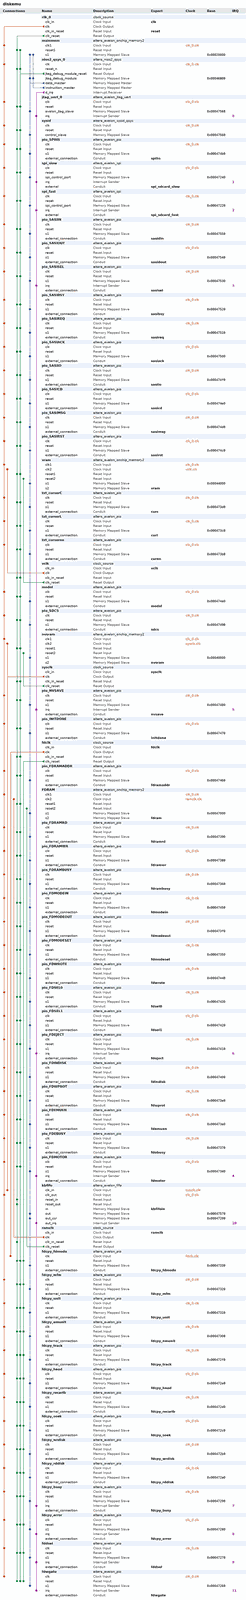
[diagram p0: system contents, whole]
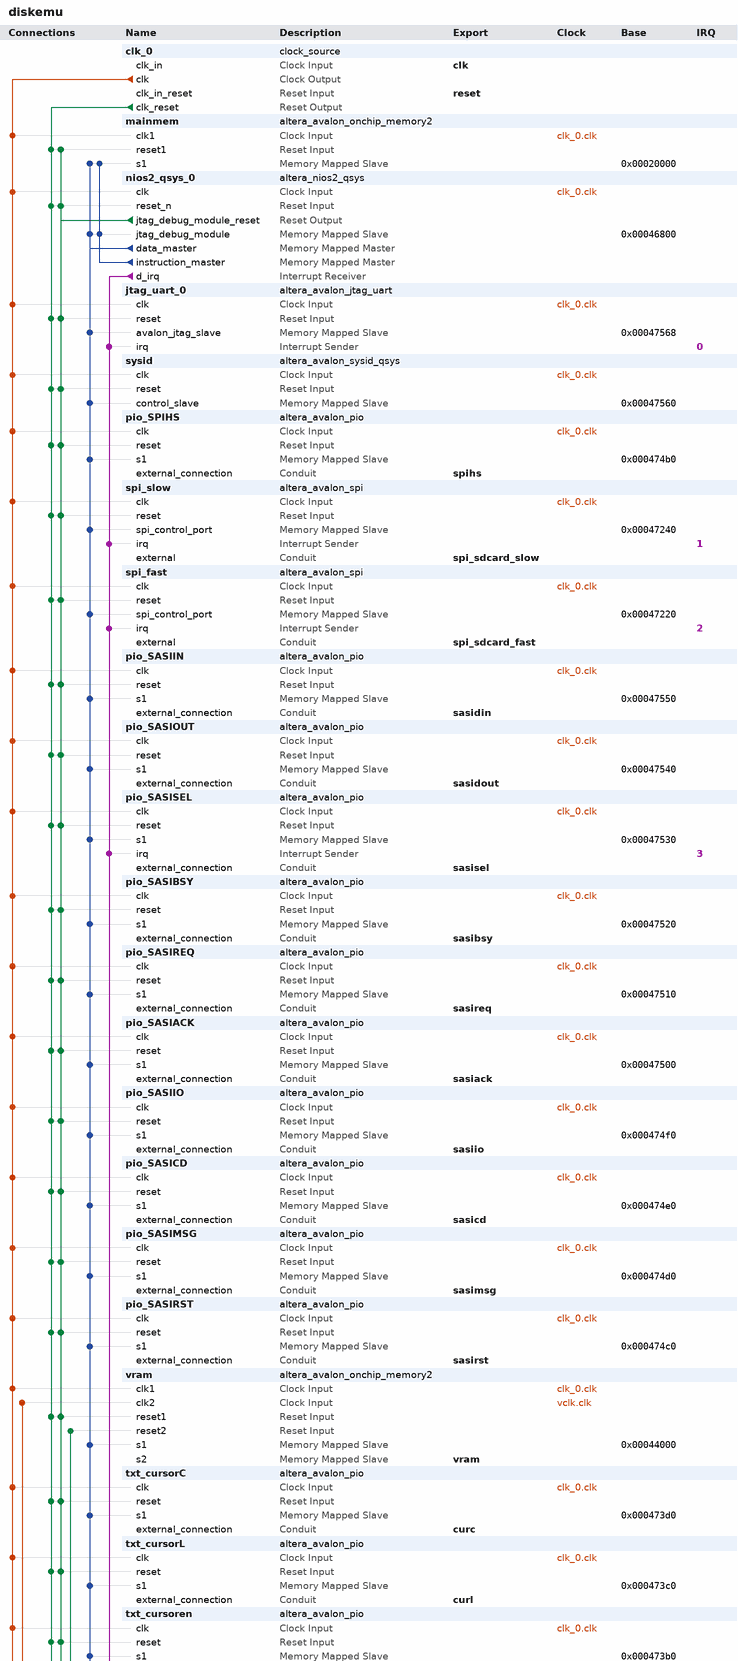
[diagram p1: system contents, upper part]
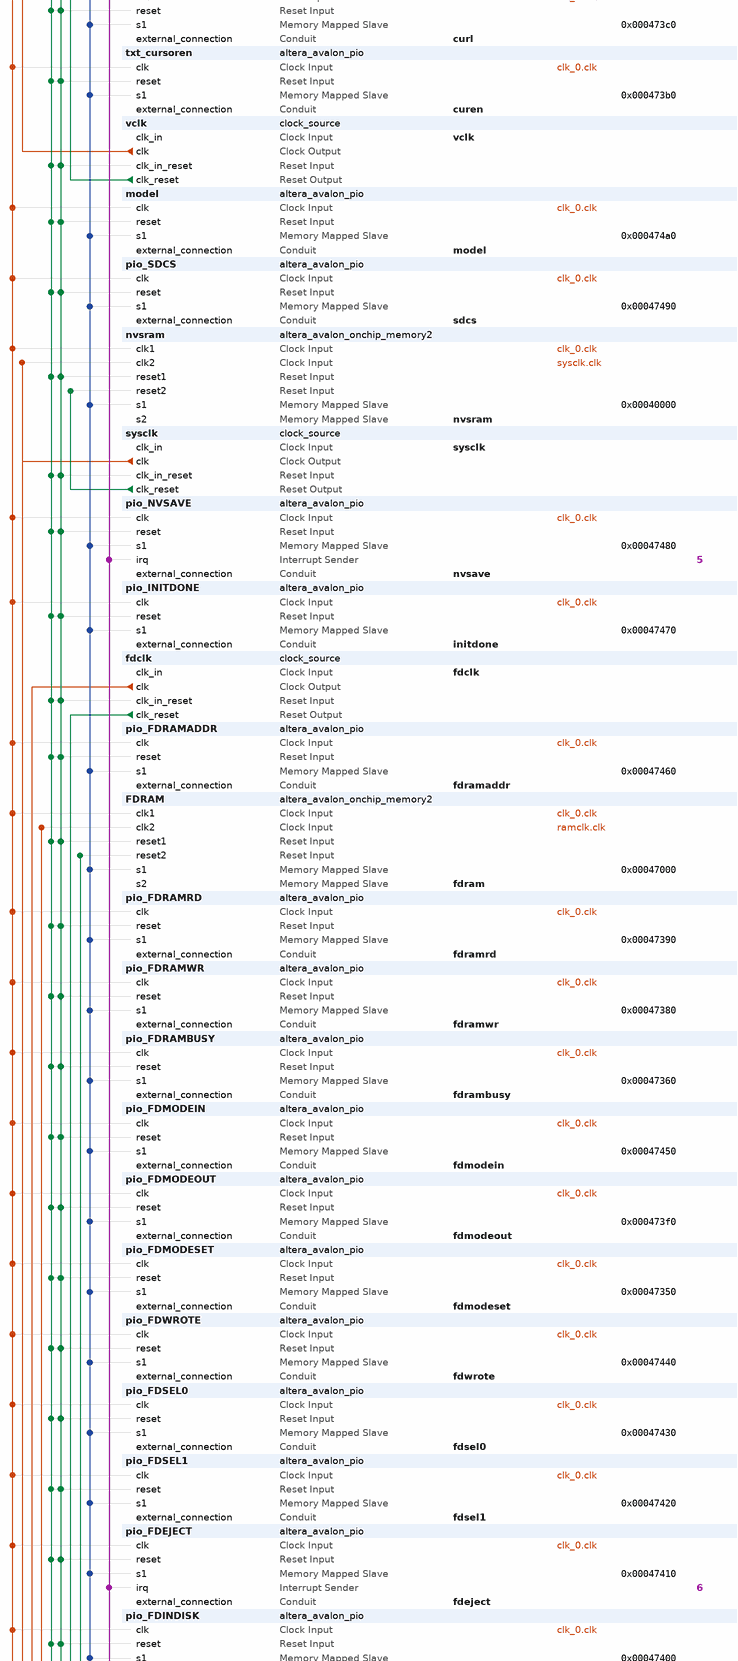
[diagram p2: system contents, middle part]
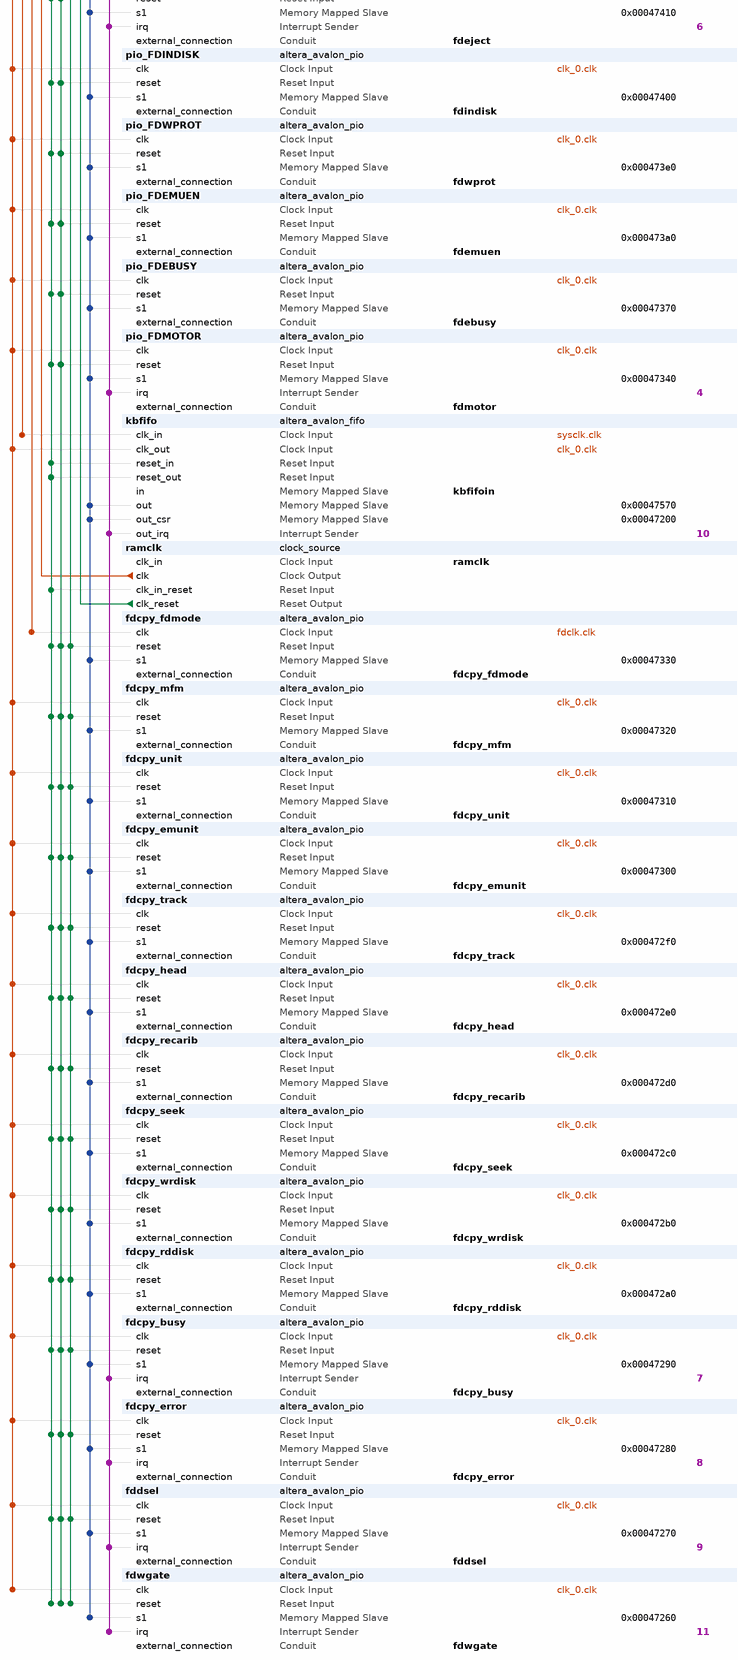
[diagram p3: system contents, lower part]
# Platform Designer (Qsys) system diskemu, Cyclone V 5CEBA4F23C7
# Parameters at their usual value, and those the tool derives, are not listed.
package require -exact qsys 13.1
create_system diskemu
set_project_property DEVICE_FAMILY {Cyclone V}
set_project_property DEVICE 5CEBA4F23C7

add_instance clk_0 clock_source 13.1
set_instance_parameter_value clk_0 clockFrequency 60000000

add_instance mainmem altera_avalon_onchip_memory2 13.1
set_instance_parameter_value mainmem dataWidth 32
set_instance_parameter_value mainmem dualPort false
set_instance_parameter_value mainmem initMemContent true
set_instance_parameter_value mainmem initializationFileName onchip_mem.hex
set_instance_parameter_value mainmem memorySize 98304

add_instance nios2_qsys_0 altera_nios2_qsys 13.1
set_instance_parameter_value nios2_qsys_0 resetSlave mainmem.s1
set_instance_parameter_value nios2_qsys_0 mmu_TLBMissExcSlave None
set_instance_parameter_value nios2_qsys_0 exceptionSlave mainmem.s1
set_instance_parameter_value nios2_qsys_0 breakSlave nios2_qsys_0.jtag_debug_module
set_instance_parameter_value nios2_qsys_0 impl Tiny
set_instance_parameter_value nios2_qsys_0 icache_size 4096

add_instance jtag_uart_0 altera_avalon_jtag_uart 13.1
set_instance_parameter_value jtag_uart_0 simInteractiveOptions NO_INTERACTIVE_WINDOWS

add_instance sysid altera_avalon_sysid_qsys 13.1
set_instance_parameter_value sysid id 0

add_instance pio_SPIHS altera_avalon_pio 13.1
set_instance_parameter_value pio_SPIHS direction Output
set_instance_parameter_value pio_SPIHS width 1

add_instance spi_slow altera_avalon_spi 13.1
set_instance_parameter_value spi_slow clockPhase 1
set_instance_parameter_value spi_slow clockPolarity 1
set_instance_parameter_value spi_slow dataWidth 8
set_instance_parameter_value spi_slow masterSPI true
set_instance_parameter_value spi_slow numberOfSlaves 1
set_instance_parameter_value spi_slow targetClockRate 150000

add_instance spi_fast altera_avalon_spi 13.1
set_instance_parameter_value spi_fast clockPhase 1
set_instance_parameter_value spi_fast clockPolarity 1
set_instance_parameter_value spi_fast dataWidth 8
set_instance_parameter_value spi_fast masterSPI true
set_instance_parameter_value spi_fast numberOfSlaves 1
set_instance_parameter_value spi_fast targetClockRate 20000000

add_instance pio_SASIIN altera_avalon_pio 13.1
set_instance_parameter_value pio_SASIIN captureEdge true
set_instance_parameter_value pio_SASIIN direction Input
set_instance_parameter_value pio_SASIIN width 8

add_instance pio_SASIOUT altera_avalon_pio 13.1
set_instance_parameter_value pio_SASIOUT direction Output
set_instance_parameter_value pio_SASIOUT width 8

add_instance pio_SASISEL altera_avalon_pio 13.1
set_instance_parameter_value pio_SASISEL captureEdge true
set_instance_parameter_value pio_SASISEL direction Input
set_instance_parameter_value pio_SASISEL generateIRQ true
set_instance_parameter_value pio_SASISEL width 1

add_instance pio_SASIBSY altera_avalon_pio 13.1
set_instance_parameter_value pio_SASIBSY direction Output
set_instance_parameter_value pio_SASIBSY width 1

add_instance pio_SASIREQ altera_avalon_pio 13.1
set_instance_parameter_value pio_SASIREQ direction Output
set_instance_parameter_value pio_SASIREQ width 1

add_instance pio_SASIACK altera_avalon_pio 13.1
set_instance_parameter_value pio_SASIACK captureEdge true
set_instance_parameter_value pio_SASIACK direction Input
set_instance_parameter_value pio_SASIACK width 1

add_instance pio_SASIIO altera_avalon_pio 13.1
set_instance_parameter_value pio_SASIIO direction Output
set_instance_parameter_value pio_SASIIO width 1

add_instance pio_SASICD altera_avalon_pio 13.1
set_instance_parameter_value pio_SASICD captureEdge true
set_instance_parameter_value pio_SASICD direction Output
set_instance_parameter_value pio_SASICD width 1

add_instance pio_SASIMSG altera_avalon_pio 13.1
set_instance_parameter_value pio_SASIMSG direction Output
set_instance_parameter_value pio_SASIMSG width 1

add_instance pio_SASIRST altera_avalon_pio 13.1
set_instance_parameter_value pio_SASIRST captureEdge true
set_instance_parameter_value pio_SASIRST direction Input
set_instance_parameter_value pio_SASIRST width 1

add_instance vram altera_avalon_onchip_memory2 13.1
set_instance_parameter_value vram dataWidth 8
set_instance_parameter_value vram dualPort true
set_instance_parameter_value vram initMemContent false
set_instance_parameter_value vram initializationFileName onchip_mem.hex
set_instance_parameter_value vram memorySize 8192

add_instance txt_cursorC altera_avalon_pio 13.1
set_instance_parameter_value txt_cursorC direction Output
set_instance_parameter_value txt_cursorC width 7

add_instance txt_cursorL altera_avalon_pio 13.1
set_instance_parameter_value txt_cursorL direction Output
set_instance_parameter_value txt_cursorL width 6

add_instance txt_cursoren altera_avalon_pio 13.1
set_instance_parameter_value txt_cursoren direction Output
set_instance_parameter_value txt_cursoren width 1

add_instance vclk clock_source 13.1
set_instance_parameter_value vclk clockFrequency 80000000

add_instance model altera_avalon_pio 13.1
set_instance_parameter_value model direction Input
set_instance_parameter_value model width 8

add_instance pio_SDCS altera_avalon_pio 13.1
set_instance_parameter_value pio_SDCS direction Output
set_instance_parameter_value pio_SDCS resetValue 1
set_instance_parameter_value pio_SDCS width 1

add_instance nvsram altera_avalon_onchip_memory2 13.1
set_instance_parameter_value nvsram dataWidth 16
set_instance_parameter_value nvsram dualPort true
set_instance_parameter_value nvsram initMemContent true
set_instance_parameter_value nvsram initializationFileName "H:\\FPGA\\diskemu.v2\\sramdefault.hex"
set_instance_parameter_value nvsram memorySize 16384
set_instance_parameter_value nvsram useNonDefaultInitFile true

add_instance sysclk clock_source 13.1
set_instance_parameter_value sysclk clockFrequency 10000000

add_instance pio_NVSAVE altera_avalon_pio 13.1
set_instance_parameter_value pio_NVSAVE captureEdge true
set_instance_parameter_value pio_NVSAVE direction Input
set_instance_parameter_value pio_NVSAVE generateIRQ true
set_instance_parameter_value pio_NVSAVE irqType EDGE
set_instance_parameter_value pio_NVSAVE width 1

add_instance pio_INITDONE altera_avalon_pio 13.1
set_instance_parameter_value pio_INITDONE direction Output
set_instance_parameter_value pio_INITDONE width 1

add_instance fdclk clock_source 13.1
set_instance_parameter_value fdclk clockFrequency 30000000

add_instance pio_FDRAMADDR altera_avalon_pio 13.1
set_instance_parameter_value pio_FDRAMADDR direction Output
set_instance_parameter_value pio_FDRAMADDR edgeType ANY
set_instance_parameter_value pio_FDRAMADDR width 16

add_instance FDRAM altera_avalon_onchip_memory2 13.1
set_instance_parameter_value FDRAM dataWidth 16
set_instance_parameter_value FDRAM dualPort true
set_instance_parameter_value FDRAM initMemContent false
set_instance_parameter_value FDRAM initializationFileName onchip_mem.hex
set_instance_parameter_value FDRAM memorySize 512

add_instance pio_FDRAMRD altera_avalon_pio 13.1
set_instance_parameter_value pio_FDRAMRD direction Output
set_instance_parameter_value pio_FDRAMRD edgeType ANY
set_instance_parameter_value pio_FDRAMRD width 1

add_instance pio_FDRAMWR altera_avalon_pio 13.1
set_instance_parameter_value pio_FDRAMWR direction Output
set_instance_parameter_value pio_FDRAMWR edgeType ANY
set_instance_parameter_value pio_FDRAMWR width 1

add_instance pio_FDRAMBUSY altera_avalon_pio 13.1
set_instance_parameter_value pio_FDRAMBUSY direction Input
set_instance_parameter_value pio_FDRAMBUSY edgeType ANY
set_instance_parameter_value pio_FDRAMBUSY width 1

add_instance pio_FDMODEIN altera_avalon_pio 13.1
set_instance_parameter_value pio_FDMODEIN direction Input
set_instance_parameter_value pio_FDMODEIN width 8

add_instance pio_FDMODEOUT altera_avalon_pio 13.1
set_instance_parameter_value pio_FDMODEOUT direction Output
set_instance_parameter_value pio_FDMODEOUT width 8

add_instance pio_FDMODESET altera_avalon_pio 13.1
set_instance_parameter_value pio_FDMODESET direction Output
set_instance_parameter_value pio_FDMODESET width 4

add_instance pio_FDWROTE altera_avalon_pio 13.1
set_instance_parameter_value pio_FDWROTE captureEdge true
set_instance_parameter_value pio_FDWROTE direction Input
set_instance_parameter_value pio_FDWROTE width 4

add_instance pio_FDSEL0 altera_avalon_pio 13.1
set_instance_parameter_value pio_FDSEL0 direction Output
set_instance_parameter_value pio_FDSEL0 resetValue 1
set_instance_parameter_value pio_FDSEL0 width 4

add_instance pio_FDSEL1 altera_avalon_pio 13.1
set_instance_parameter_value pio_FDSEL1 direction Output
set_instance_parameter_value pio_FDSEL1 resetValue 2
set_instance_parameter_value pio_FDSEL1 width 4

add_instance pio_FDEJECT altera_avalon_pio 13.1
set_instance_parameter_value pio_FDEJECT captureEdge true
set_instance_parameter_value pio_FDEJECT direction Input
set_instance_parameter_value pio_FDEJECT generateIRQ true
set_instance_parameter_value pio_FDEJECT irqType EDGE
set_instance_parameter_value pio_FDEJECT width 4

add_instance pio_FDINDISK altera_avalon_pio 13.1
set_instance_parameter_value pio_FDINDISK direction Output
set_instance_parameter_value pio_FDINDISK width 4

add_instance pio_FDWPROT altera_avalon_pio 13.1
set_instance_parameter_value pio_FDWPROT direction Output
set_instance_parameter_value pio_FDWPROT width 4

add_instance pio_FDEMUEN altera_avalon_pio 13.1
set_instance_parameter_value pio_FDEMUEN direction Output
set_instance_parameter_value pio_FDEMUEN width 4

add_instance pio_FDEBUSY altera_avalon_pio 13.1
set_instance_parameter_value pio_FDEBUSY direction Output
set_instance_parameter_value pio_FDEBUSY width 1

add_instance pio_FDMOTOR altera_avalon_pio 13.1
set_instance_parameter_value pio_FDMOTOR captureEdge true
set_instance_parameter_value pio_FDMOTOR direction Input
set_instance_parameter_value pio_FDMOTOR edgeType FALLING
set_instance_parameter_value pio_FDMOTOR generateIRQ true
set_instance_parameter_value pio_FDMOTOR irqType EDGE
set_instance_parameter_value pio_FDMOTOR width 4

add_instance kbfifo altera_avalon_fifo 13.1
set_instance_parameter_value kbfifo bitsPerSymbol 16
set_instance_parameter_value kbfifo channelWidth 8
set_instance_parameter_value kbfifo errorWidth 8
set_instance_parameter_value kbfifo fifoDepth 16
set_instance_parameter_value kbfifo fifoInputInterfaceOptions AVALONMM_WRITE
set_instance_parameter_value kbfifo fifoOutputInterfaceOptions AVALONMM_READ
set_instance_parameter_value kbfifo singleClockMode false
set_instance_parameter_value kbfifo singleResetMode true
set_instance_parameter_value kbfifo symbolsPerBeat 2
set_instance_parameter_value kbfifo useIRQ true
set_instance_parameter_value kbfifo usePacket true
set_instance_parameter_value kbfifo useReadControl true
set_instance_parameter_value kbfifo useWriteControl false

add_instance ramclk clock_source 13.1
set_instance_parameter_value ramclk clockFrequency 10000000

add_instance fdcpy_fdmode altera_avalon_pio 13.1
set_instance_parameter_value fdcpy_fdmode direction Output
set_instance_parameter_value fdcpy_fdmode width 2

add_instance fdcpy_mfm altera_avalon_pio 13.1
set_instance_parameter_value fdcpy_mfm direction Output
set_instance_parameter_value fdcpy_mfm width 1

add_instance fdcpy_unit altera_avalon_pio 13.1
set_instance_parameter_value fdcpy_unit direction Output
set_instance_parameter_value fdcpy_unit width 1

add_instance fdcpy_emunit altera_avalon_pio 13.1
set_instance_parameter_value fdcpy_emunit direction Output
set_instance_parameter_value fdcpy_emunit width 2

add_instance fdcpy_track altera_avalon_pio 13.1
set_instance_parameter_value fdcpy_track direction Output
set_instance_parameter_value fdcpy_track width 7

add_instance fdcpy_head altera_avalon_pio 13.1
set_instance_parameter_value fdcpy_head direction Output
set_instance_parameter_value fdcpy_head width 1

add_instance fdcpy_recarib altera_avalon_pio 13.1
set_instance_parameter_value fdcpy_recarib direction Output
set_instance_parameter_value fdcpy_recarib width 1

add_instance fdcpy_seek altera_avalon_pio 13.1
set_instance_parameter_value fdcpy_seek direction Output
set_instance_parameter_value fdcpy_seek width 1

add_instance fdcpy_wrdisk altera_avalon_pio 13.1
set_instance_parameter_value fdcpy_wrdisk direction Output
set_instance_parameter_value fdcpy_wrdisk width 1

add_instance fdcpy_rddisk altera_avalon_pio 13.1
set_instance_parameter_value fdcpy_rddisk direction Output
set_instance_parameter_value fdcpy_rddisk width 1

add_instance fdcpy_busy altera_avalon_pio 13.1
set_instance_parameter_value fdcpy_busy captureEdge true
set_instance_parameter_value fdcpy_busy direction Input
set_instance_parameter_value fdcpy_busy edgeType FALLING
set_instance_parameter_value fdcpy_busy generateIRQ true
set_instance_parameter_value fdcpy_busy width 1

add_instance fdcpy_error altera_avalon_pio 13.1
set_instance_parameter_value fdcpy_error captureEdge true
set_instance_parameter_value fdcpy_error direction Input
set_instance_parameter_value fdcpy_error generateIRQ true
set_instance_parameter_value fdcpy_error width 1

add_instance fddsel altera_avalon_pio 13.1
set_instance_parameter_value fddsel captureEdge true
set_instance_parameter_value fddsel direction Input
set_instance_parameter_value fddsel edgeType ANY
set_instance_parameter_value fddsel generateIRQ true
set_instance_parameter_value fddsel irqType EDGE
set_instance_parameter_value fddsel width 4

add_instance fdwgate altera_avalon_pio 13.1
set_instance_parameter_value fdwgate captureEdge true
set_instance_parameter_value fdwgate direction Input
set_instance_parameter_value fdwgate edgeType ANY
set_instance_parameter_value fdwgate generateIRQ true
set_instance_parameter_value fdwgate irqType EDGE
set_instance_parameter_value fdwgate width 1

# connections
add_connection clk_0.clk fdcpy_busy.clk clock
add_connection clk_0.clk fdcpy_emunit.clk clock
add_connection clk_0.clk fdcpy_error.clk clock
add_connection clk_0.clk fdcpy_head.clk clock
add_connection clk_0.clk fdcpy_mfm.clk clock
add_connection clk_0.clk fdcpy_rddisk.clk clock
add_connection clk_0.clk fdcpy_recarib.clk clock
add_connection clk_0.clk fdcpy_seek.clk clock
add_connection clk_0.clk fdcpy_track.clk clock
add_connection clk_0.clk fdcpy_unit.clk clock
add_connection clk_0.clk fdcpy_wrdisk.clk clock
add_connection clk_0.clk fddsel.clk clock
add_connection clk_0.clk FDRAM.clk1 clock
add_connection clk_0.clk fdwgate.clk clock
add_connection clk_0.clk jtag_uart_0.clk clock
add_connection clk_0.clk kbfifo.clk_out clock
add_connection clk_0.clk mainmem.clk1 clock
add_connection clk_0.clk model.clk clock
add_connection clk_0.clk nios2_qsys_0.clk clock
add_connection clk_0.clk nvsram.clk1 clock
add_connection clk_0.clk pio_FDEBUSY.clk clock
add_connection clk_0.clk pio_FDEJECT.clk clock
add_connection clk_0.clk pio_FDEMUEN.clk clock
add_connection clk_0.clk pio_FDINDISK.clk clock
add_connection clk_0.clk pio_FDMODEIN.clk clock
add_connection clk_0.clk pio_FDMODEOUT.clk clock
add_connection clk_0.clk pio_FDMODESET.clk clock
add_connection clk_0.clk pio_FDMOTOR.clk clock
add_connection clk_0.clk pio_FDRAMADDR.clk clock
add_connection clk_0.clk pio_FDRAMBUSY.clk clock
add_connection clk_0.clk pio_FDRAMRD.clk clock
add_connection clk_0.clk pio_FDRAMWR.clk clock
add_connection clk_0.clk pio_FDSEL0.clk clock
add_connection clk_0.clk pio_FDSEL1.clk clock
add_connection clk_0.clk pio_FDWPROT.clk clock
add_connection clk_0.clk pio_FDWROTE.clk clock
add_connection clk_0.clk pio_INITDONE.clk clock
add_connection clk_0.clk pio_NVSAVE.clk clock
add_connection clk_0.clk pio_SASIACK.clk clock
add_connection clk_0.clk pio_SASIBSY.clk clock
add_connection clk_0.clk pio_SASICD.clk clock
add_connection clk_0.clk pio_SASIIN.clk clock
add_connection clk_0.clk pio_SASIIO.clk clock
add_connection clk_0.clk pio_SASIMSG.clk clock
add_connection clk_0.clk pio_SASIOUT.clk clock
add_connection clk_0.clk pio_SASIREQ.clk clock
add_connection clk_0.clk pio_SASIRST.clk clock
add_connection clk_0.clk pio_SASISEL.clk clock
add_connection clk_0.clk pio_SDCS.clk clock
add_connection clk_0.clk pio_SPIHS.clk clock
add_connection clk_0.clk spi_fast.clk clock
add_connection clk_0.clk spi_slow.clk clock
add_connection clk_0.clk sysid.clk clock
add_connection clk_0.clk txt_cursorC.clk clock
add_connection clk_0.clk txt_cursoren.clk clock
add_connection clk_0.clk txt_cursorL.clk clock
add_connection clk_0.clk vram.clk1 clock
add_connection fdclk.clk fdcpy_fdmode.clk clock
add_connection ramclk.clk FDRAM.clk2 clock
add_connection sysclk.clk kbfifo.clk_in clock
add_connection sysclk.clk nvsram.clk2 clock
add_connection vclk.clk vram.clk2 clock
add_connection clk_0.clk_reset fdclk.clk_in_reset reset
add_connection clk_0.clk_reset fdcpy_busy.reset reset
add_connection clk_0.clk_reset fdcpy_emunit.reset reset
add_connection clk_0.clk_reset fdcpy_error.reset reset
add_connection clk_0.clk_reset fdcpy_fdmode.reset reset
add_connection clk_0.clk_reset fdcpy_head.reset reset
add_connection clk_0.clk_reset fdcpy_mfm.reset reset
add_connection clk_0.clk_reset fdcpy_rddisk.reset reset
add_connection clk_0.clk_reset fdcpy_recarib.reset reset
add_connection clk_0.clk_reset fdcpy_seek.reset reset
add_connection clk_0.clk_reset fdcpy_track.reset reset
add_connection clk_0.clk_reset fdcpy_unit.reset reset
add_connection clk_0.clk_reset fdcpy_wrdisk.reset reset
add_connection clk_0.clk_reset fddsel.reset reset
add_connection clk_0.clk_reset FDRAM.reset1 reset
add_connection clk_0.clk_reset fdwgate.reset reset
add_connection clk_0.clk_reset jtag_uart_0.reset reset
add_connection clk_0.clk_reset kbfifo.reset_in reset
add_connection clk_0.clk_reset kbfifo.reset_out reset
add_connection clk_0.clk_reset mainmem.reset1 reset
add_connection clk_0.clk_reset model.reset reset
add_connection clk_0.clk_reset nios2_qsys_0.reset_n reset
add_connection clk_0.clk_reset nvsram.reset1 reset
add_connection clk_0.clk_reset pio_FDEBUSY.reset reset
add_connection clk_0.clk_reset pio_FDEJECT.reset reset
add_connection clk_0.clk_reset pio_FDEMUEN.reset reset
add_connection clk_0.clk_reset pio_FDINDISK.reset reset
add_connection clk_0.clk_reset pio_FDMODEIN.reset reset
add_connection clk_0.clk_reset pio_FDMODEOUT.reset reset
add_connection clk_0.clk_reset pio_FDMODESET.reset reset
add_connection clk_0.clk_reset pio_FDMOTOR.reset reset
add_connection clk_0.clk_reset pio_FDRAMADDR.reset reset
add_connection clk_0.clk_reset pio_FDRAMBUSY.reset reset
add_connection clk_0.clk_reset pio_FDRAMRD.reset reset
add_connection clk_0.clk_reset pio_FDRAMWR.reset reset
add_connection clk_0.clk_reset pio_FDSEL0.reset reset
add_connection clk_0.clk_reset pio_FDSEL1.reset reset
add_connection clk_0.clk_reset pio_FDWPROT.reset reset
add_connection clk_0.clk_reset pio_FDWROTE.reset reset
add_connection clk_0.clk_reset pio_INITDONE.reset reset
add_connection clk_0.clk_reset pio_NVSAVE.reset reset
add_connection clk_0.clk_reset pio_SASIACK.reset reset
add_connection clk_0.clk_reset pio_SASIBSY.reset reset
add_connection clk_0.clk_reset pio_SASICD.reset reset
add_connection clk_0.clk_reset pio_SASIIN.reset reset
add_connection clk_0.clk_reset pio_SASIIO.reset reset
add_connection clk_0.clk_reset pio_SASIMSG.reset reset
add_connection clk_0.clk_reset pio_SASIOUT.reset reset
add_connection clk_0.clk_reset pio_SASIREQ.reset reset
add_connection clk_0.clk_reset pio_SASIRST.reset reset
add_connection clk_0.clk_reset pio_SASISEL.reset reset
add_connection clk_0.clk_reset pio_SDCS.reset reset
add_connection clk_0.clk_reset pio_SPIHS.reset reset
add_connection clk_0.clk_reset ramclk.clk_in_reset reset
add_connection clk_0.clk_reset spi_fast.reset reset
add_connection clk_0.clk_reset spi_slow.reset reset
add_connection clk_0.clk_reset sysclk.clk_in_reset reset
add_connection clk_0.clk_reset sysid.reset reset
add_connection clk_0.clk_reset txt_cursorC.reset reset
add_connection clk_0.clk_reset txt_cursoren.reset reset
add_connection clk_0.clk_reset txt_cursorL.reset reset
add_connection clk_0.clk_reset vclk.clk_in_reset reset
add_connection clk_0.clk_reset vram.reset1 reset
add_connection fdclk.clk_reset fdcpy_busy.reset reset
add_connection fdclk.clk_reset fdcpy_emunit.reset reset
add_connection fdclk.clk_reset fdcpy_error.reset reset
add_connection fdclk.clk_reset fdcpy_fdmode.reset reset
add_connection fdclk.clk_reset fdcpy_head.reset reset
add_connection fdclk.clk_reset fdcpy_mfm.reset reset
add_connection fdclk.clk_reset fdcpy_rddisk.reset reset
add_connection fdclk.clk_reset fdcpy_recarib.reset reset
add_connection fdclk.clk_reset fdcpy_seek.reset reset
add_connection fdclk.clk_reset fdcpy_track.reset reset
add_connection fdclk.clk_reset fdcpy_unit.reset reset
add_connection fdclk.clk_reset fdcpy_wrdisk.reset reset
add_connection fdclk.clk_reset fddsel.reset reset
add_connection fdclk.clk_reset fdwgate.reset reset
add_connection nios2_qsys_0.jtag_debug_module_reset fdclk.clk_in_reset reset
add_connection nios2_qsys_0.jtag_debug_module_reset fdcpy_busy.reset reset
add_connection nios2_qsys_0.jtag_debug_module_reset fdcpy_emunit.reset reset
add_connection nios2_qsys_0.jtag_debug_module_reset fdcpy_error.reset reset
add_connection nios2_qsys_0.jtag_debug_module_reset fdcpy_fdmode.reset reset
add_connection nios2_qsys_0.jtag_debug_module_reset fdcpy_head.reset reset
add_connection nios2_qsys_0.jtag_debug_module_reset fdcpy_mfm.reset reset
add_connection nios2_qsys_0.jtag_debug_module_reset fdcpy_rddisk.reset reset
add_connection nios2_qsys_0.jtag_debug_module_reset fdcpy_recarib.reset reset
add_connection nios2_qsys_0.jtag_debug_module_reset fdcpy_seek.reset reset
add_connection nios2_qsys_0.jtag_debug_module_reset fdcpy_track.reset reset
add_connection nios2_qsys_0.jtag_debug_module_reset fdcpy_unit.reset reset
add_connection nios2_qsys_0.jtag_debug_module_reset fdcpy_wrdisk.reset reset
add_connection nios2_qsys_0.jtag_debug_module_reset fddsel.reset reset
add_connection nios2_qsys_0.jtag_debug_module_reset FDRAM.reset1 reset
add_connection nios2_qsys_0.jtag_debug_module_reset fdwgate.reset reset
add_connection nios2_qsys_0.jtag_debug_module_reset jtag_uart_0.reset reset
add_connection nios2_qsys_0.jtag_debug_module_reset mainmem.reset1 reset
add_connection nios2_qsys_0.jtag_debug_module_reset model.reset reset
add_connection nios2_qsys_0.jtag_debug_module_reset nios2_qsys_0.reset_n reset
add_connection nios2_qsys_0.jtag_debug_module_reset nvsram.reset1 reset
add_connection nios2_qsys_0.jtag_debug_module_reset pio_FDEBUSY.reset reset
add_connection nios2_qsys_0.jtag_debug_module_reset pio_FDEJECT.reset reset
add_connection nios2_qsys_0.jtag_debug_module_reset pio_FDEMUEN.reset reset
add_connection nios2_qsys_0.jtag_debug_module_reset pio_FDINDISK.reset reset
add_connection nios2_qsys_0.jtag_debug_module_reset pio_FDMODEIN.reset reset
add_connection nios2_qsys_0.jtag_debug_module_reset pio_FDMODEOUT.reset reset
add_connection nios2_qsys_0.jtag_debug_module_reset pio_FDMODESET.reset reset
add_connection nios2_qsys_0.jtag_debug_module_reset pio_FDMOTOR.reset reset
add_connection nios2_qsys_0.jtag_debug_module_reset pio_FDRAMADDR.reset reset
add_connection nios2_qsys_0.jtag_debug_module_reset pio_FDRAMBUSY.reset reset
add_connection nios2_qsys_0.jtag_debug_module_reset pio_FDRAMRD.reset reset
add_connection nios2_qsys_0.jtag_debug_module_reset pio_FDRAMWR.reset reset
add_connection nios2_qsys_0.jtag_debug_module_reset pio_FDSEL0.reset reset
add_connection nios2_qsys_0.jtag_debug_module_reset pio_FDSEL1.reset reset
add_connection nios2_qsys_0.jtag_debug_module_reset pio_FDWPROT.reset reset
add_connection nios2_qsys_0.jtag_debug_module_reset pio_FDWROTE.reset reset
add_connection nios2_qsys_0.jtag_debug_module_reset pio_INITDONE.reset reset
add_connection nios2_qsys_0.jtag_debug_module_reset pio_NVSAVE.reset reset
add_connection nios2_qsys_0.jtag_debug_module_reset pio_SASIACK.reset reset
add_connection nios2_qsys_0.jtag_debug_module_reset pio_SASIBSY.reset reset
add_connection nios2_qsys_0.jtag_debug_module_reset pio_SASICD.reset reset
add_connection nios2_qsys_0.jtag_debug_module_reset pio_SASIIN.reset reset
add_connection nios2_qsys_0.jtag_debug_module_reset pio_SASIIO.reset reset
add_connection nios2_qsys_0.jtag_debug_module_reset pio_SASIMSG.reset reset
add_connection nios2_qsys_0.jtag_debug_module_reset pio_SASIOUT.reset reset
add_connection nios2_qsys_0.jtag_debug_module_reset pio_SASIREQ.reset reset
add_connection nios2_qsys_0.jtag_debug_module_reset pio_SASIRST.reset reset
add_connection nios2_qsys_0.jtag_debug_module_reset pio_SASISEL.reset reset
add_connection nios2_qsys_0.jtag_debug_module_reset pio_SDCS.reset reset
add_connection nios2_qsys_0.jtag_debug_module_reset pio_SPIHS.reset reset
add_connection nios2_qsys_0.jtag_debug_module_reset spi_fast.reset reset
add_connection nios2_qsys_0.jtag_debug_module_reset spi_slow.reset reset
add_connection nios2_qsys_0.jtag_debug_module_reset sysclk.clk_in_reset reset
add_connection nios2_qsys_0.jtag_debug_module_reset sysid.reset reset
add_connection nios2_qsys_0.jtag_debug_module_reset txt_cursorC.reset reset
add_connection nios2_qsys_0.jtag_debug_module_reset txt_cursoren.reset reset
add_connection nios2_qsys_0.jtag_debug_module_reset txt_cursorL.reset reset
add_connection nios2_qsys_0.jtag_debug_module_reset vclk.clk_in_reset reset
add_connection nios2_qsys_0.jtag_debug_module_reset vram.reset1 reset
add_connection ramclk.clk_reset FDRAM.reset2 reset
add_connection sysclk.clk_reset nvsram.reset2 reset
add_connection vclk.clk_reset vram.reset2 reset
add_connection nios2_qsys_0.data_master fdcpy_busy.s1 avalon
set_connection_parameter_value nios2_qsys_0.data_master/fdcpy_busy.s1 baseAddress 0x00047290
add_connection nios2_qsys_0.data_master fdcpy_emunit.s1 avalon
set_connection_parameter_value nios2_qsys_0.data_master/fdcpy_emunit.s1 baseAddress 0x00047300
add_connection nios2_qsys_0.data_master fdcpy_error.s1 avalon
set_connection_parameter_value nios2_qsys_0.data_master/fdcpy_error.s1 baseAddress 0x00047280
add_connection nios2_qsys_0.data_master fdcpy_fdmode.s1 avalon
set_connection_parameter_value nios2_qsys_0.data_master/fdcpy_fdmode.s1 baseAddress 0x00047330
add_connection nios2_qsys_0.data_master fdcpy_head.s1 avalon
set_connection_parameter_value nios2_qsys_0.data_master/fdcpy_head.s1 baseAddress 0x000472e0
add_connection nios2_qsys_0.data_master fdcpy_mfm.s1 avalon
set_connection_parameter_value nios2_qsys_0.data_master/fdcpy_mfm.s1 baseAddress 0x00047320
add_connection nios2_qsys_0.data_master fdcpy_rddisk.s1 avalon
set_connection_parameter_value nios2_qsys_0.data_master/fdcpy_rddisk.s1 baseAddress 0x000472a0
add_connection nios2_qsys_0.data_master fdcpy_recarib.s1 avalon
set_connection_parameter_value nios2_qsys_0.data_master/fdcpy_recarib.s1 baseAddress 0x000472d0
add_connection nios2_qsys_0.data_master fdcpy_seek.s1 avalon
set_connection_parameter_value nios2_qsys_0.data_master/fdcpy_seek.s1 baseAddress 0x000472c0
add_connection nios2_qsys_0.data_master fdcpy_track.s1 avalon
set_connection_parameter_value nios2_qsys_0.data_master/fdcpy_track.s1 baseAddress 0x000472f0
add_connection nios2_qsys_0.data_master fdcpy_unit.s1 avalon
set_connection_parameter_value nios2_qsys_0.data_master/fdcpy_unit.s1 baseAddress 0x00047310
add_connection nios2_qsys_0.data_master fdcpy_wrdisk.s1 avalon
set_connection_parameter_value nios2_qsys_0.data_master/fdcpy_wrdisk.s1 baseAddress 0x000472b0
add_connection nios2_qsys_0.data_master fddsel.s1 avalon
set_connection_parameter_value nios2_qsys_0.data_master/fddsel.s1 baseAddress 0x00047270
add_connection nios2_qsys_0.data_master FDRAM.s1 avalon
set_connection_parameter_value nios2_qsys_0.data_master/FDRAM.s1 baseAddress 0x00047000
add_connection nios2_qsys_0.data_master fdwgate.s1 avalon
set_connection_parameter_value nios2_qsys_0.data_master/fdwgate.s1 baseAddress 0x00047260
add_connection nios2_qsys_0.data_master jtag_uart_0.avalon_jtag_slave avalon
set_connection_parameter_value nios2_qsys_0.data_master/jtag_uart_0.avalon_jtag_slave baseAddress 0x00047568
add_connection nios2_qsys_0.data_master kbfifo.out avalon
set_connection_parameter_value nios2_qsys_0.data_master/kbfifo.out baseAddress 0x00047570
add_connection nios2_qsys_0.data_master kbfifo.out_csr avalon
set_connection_parameter_value nios2_qsys_0.data_master/kbfifo.out_csr baseAddress 0x00047200
add_connection nios2_qsys_0.data_master mainmem.s1 avalon
set_connection_parameter_value nios2_qsys_0.data_master/mainmem.s1 baseAddress 0x00020000
add_connection nios2_qsys_0.data_master model.s1 avalon
set_connection_parameter_value nios2_qsys_0.data_master/model.s1 baseAddress 0x000474a0
add_connection nios2_qsys_0.data_master nios2_qsys_0.jtag_debug_module avalon
set_connection_parameter_value nios2_qsys_0.data_master/nios2_qsys_0.jtag_debug_module baseAddress 0x00046800
add_connection nios2_qsys_0.data_master nvsram.s1 avalon
set_connection_parameter_value nios2_qsys_0.data_master/nvsram.s1 baseAddress 0x00040000
add_connection nios2_qsys_0.data_master pio_FDEBUSY.s1 avalon
set_connection_parameter_value nios2_qsys_0.data_master/pio_FDEBUSY.s1 baseAddress 0x00047370
add_connection nios2_qsys_0.data_master pio_FDEJECT.s1 avalon
set_connection_parameter_value nios2_qsys_0.data_master/pio_FDEJECT.s1 baseAddress 0x00047410
add_connection nios2_qsys_0.data_master pio_FDEMUEN.s1 avalon
set_connection_parameter_value nios2_qsys_0.data_master/pio_FDEMUEN.s1 baseAddress 0x000473a0
add_connection nios2_qsys_0.data_master pio_FDINDISK.s1 avalon
set_connection_parameter_value nios2_qsys_0.data_master/pio_FDINDISK.s1 baseAddress 0x00047400
add_connection nios2_qsys_0.data_master pio_FDMODEIN.s1 avalon
set_connection_parameter_value nios2_qsys_0.data_master/pio_FDMODEIN.s1 baseAddress 0x00047450
add_connection nios2_qsys_0.data_master pio_FDMODEOUT.s1 avalon
set_connection_parameter_value nios2_qsys_0.data_master/pio_FDMODEOUT.s1 baseAddress 0x000473f0
add_connection nios2_qsys_0.data_master pio_FDMODESET.s1 avalon
set_connection_parameter_value nios2_qsys_0.data_master/pio_FDMODESET.s1 baseAddress 0x00047350
add_connection nios2_qsys_0.data_master pio_FDMOTOR.s1 avalon
set_connection_parameter_value nios2_qsys_0.data_master/pio_FDMOTOR.s1 baseAddress 0x00047340
add_connection nios2_qsys_0.data_master pio_FDRAMADDR.s1 avalon
set_connection_parameter_value nios2_qsys_0.data_master/pio_FDRAMADDR.s1 baseAddress 0x00047460
add_connection nios2_qsys_0.data_master pio_FDRAMBUSY.s1 avalon
set_connection_parameter_value nios2_qsys_0.data_master/pio_FDRAMBUSY.s1 baseAddress 0x00047360
add_connection nios2_qsys_0.data_master pio_FDRAMRD.s1 avalon
set_connection_parameter_value nios2_qsys_0.data_master/pio_FDRAMRD.s1 baseAddress 0x00047390
add_connection nios2_qsys_0.data_master pio_FDRAMWR.s1 avalon
set_connection_parameter_value nios2_qsys_0.data_master/pio_FDRAMWR.s1 baseAddress 0x00047380
add_connection nios2_qsys_0.data_master pio_FDSEL0.s1 avalon
set_connection_parameter_value nios2_qsys_0.data_master/pio_FDSEL0.s1 baseAddress 0x00047430
add_connection nios2_qsys_0.data_master pio_FDSEL1.s1 avalon
set_connection_parameter_value nios2_qsys_0.data_master/pio_FDSEL1.s1 baseAddress 0x00047420
add_connection nios2_qsys_0.data_master pio_FDWPROT.s1 avalon
set_connection_parameter_value nios2_qsys_0.data_master/pio_FDWPROT.s1 baseAddress 0x000473e0
add_connection nios2_qsys_0.data_master pio_FDWROTE.s1 avalon
set_connection_parameter_value nios2_qsys_0.data_master/pio_FDWROTE.s1 baseAddress 0x00047440
add_connection nios2_qsys_0.data_master pio_INITDONE.s1 avalon
set_connection_parameter_value nios2_qsys_0.data_master/pio_INITDONE.s1 baseAddress 0x00047470
add_connection nios2_qsys_0.data_master pio_NVSAVE.s1 avalon
set_connection_parameter_value nios2_qsys_0.data_master/pio_NVSAVE.s1 baseAddress 0x00047480
add_connection nios2_qsys_0.data_master pio_SASIACK.s1 avalon
set_connection_parameter_value nios2_qsys_0.data_master/pio_SASIACK.s1 baseAddress 0x00047500
add_connection nios2_qsys_0.data_master pio_SASIBSY.s1 avalon
set_connection_parameter_value nios2_qsys_0.data_master/pio_SASIBSY.s1 baseAddress 0x00047520
add_connection nios2_qsys_0.data_master pio_SASICD.s1 avalon
set_connection_parameter_value nios2_qsys_0.data_master/pio_SASICD.s1 baseAddress 0x000474e0
add_connection nios2_qsys_0.data_master pio_SASIIN.s1 avalon
set_connection_parameter_value nios2_qsys_0.data_master/pio_SASIIN.s1 baseAddress 0x00047550
add_connection nios2_qsys_0.data_master pio_SASIIO.s1 avalon
set_connection_parameter_value nios2_qsys_0.data_master/pio_SASIIO.s1 baseAddress 0x000474f0
add_connection nios2_qsys_0.data_master pio_SASIMSG.s1 avalon
set_connection_parameter_value nios2_qsys_0.data_master/pio_SASIMSG.s1 baseAddress 0x000474d0
add_connection nios2_qsys_0.data_master pio_SASIOUT.s1 avalon
set_connection_parameter_value nios2_qsys_0.data_master/pio_SASIOUT.s1 baseAddress 0x00047540
add_connection nios2_qsys_0.data_master pio_SASIREQ.s1 avalon
set_connection_parameter_value nios2_qsys_0.data_master/pio_SASIREQ.s1 baseAddress 0x00047510
add_connection nios2_qsys_0.data_master pio_SASIRST.s1 avalon
set_connection_parameter_value nios2_qsys_0.data_master/pio_SASIRST.s1 baseAddress 0x000474c0
add_connection nios2_qsys_0.data_master pio_SASISEL.s1 avalon
set_connection_parameter_value nios2_qsys_0.data_master/pio_SASISEL.s1 baseAddress 0x00047530
add_connection nios2_qsys_0.data_master pio_SDCS.s1 avalon
set_connection_parameter_value nios2_qsys_0.data_master/pio_SDCS.s1 baseAddress 0x00047490
add_connection nios2_qsys_0.data_master pio_SPIHS.s1 avalon
set_connection_parameter_value nios2_qsys_0.data_master/pio_SPIHS.s1 baseAddress 0x000474b0
add_connection nios2_qsys_0.data_master spi_fast.spi_control_port avalon
set_connection_parameter_value nios2_qsys_0.data_master/spi_fast.spi_control_port baseAddress 0x00047220
add_connection nios2_qsys_0.data_master spi_slow.spi_control_port avalon
set_connection_parameter_value nios2_qsys_0.data_master/spi_slow.spi_control_port baseAddress 0x00047240
add_connection nios2_qsys_0.data_master sysid.control_slave avalon
set_connection_parameter_value nios2_qsys_0.data_master/sysid.control_slave baseAddress 0x00047560
add_connection nios2_qsys_0.data_master txt_cursorC.s1 avalon
set_connection_parameter_value nios2_qsys_0.data_master/txt_cursorC.s1 baseAddress 0x000473d0
add_connection nios2_qsys_0.data_master txt_cursoren.s1 avalon
set_connection_parameter_value nios2_qsys_0.data_master/txt_cursoren.s1 baseAddress 0x000473b0
add_connection nios2_qsys_0.data_master txt_cursorL.s1 avalon
set_connection_parameter_value nios2_qsys_0.data_master/txt_cursorL.s1 baseAddress 0x000473c0
add_connection nios2_qsys_0.data_master vram.s1 avalon
set_connection_parameter_value nios2_qsys_0.data_master/vram.s1 baseAddress 0x00044000
add_connection nios2_qsys_0.instruction_master mainmem.s1 avalon
set_connection_parameter_value nios2_qsys_0.instruction_master/mainmem.s1 baseAddress 0x00020000
add_connection nios2_qsys_0.instruction_master nios2_qsys_0.jtag_debug_module avalon
set_connection_parameter_value nios2_qsys_0.instruction_master/nios2_qsys_0.jtag_debug_module baseAddress 0x00046800
add_connection nios2_qsys_0.d_irq fdcpy_busy.irq interrupt
set_connection_parameter_value nios2_qsys_0.d_irq/fdcpy_busy.irq irqNumber 7
add_connection nios2_qsys_0.d_irq fdcpy_error.irq interrupt
set_connection_parameter_value nios2_qsys_0.d_irq/fdcpy_error.irq irqNumber 8
add_connection nios2_qsys_0.d_irq fddsel.irq interrupt
set_connection_parameter_value nios2_qsys_0.d_irq/fddsel.irq irqNumber 9
add_connection nios2_qsys_0.d_irq fdwgate.irq interrupt
set_connection_parameter_value nios2_qsys_0.d_irq/fdwgate.irq irqNumber 11
add_connection nios2_qsys_0.d_irq jtag_uart_0.irq interrupt
set_connection_parameter_value nios2_qsys_0.d_irq/jtag_uart_0.irq irqNumber 0
add_connection nios2_qsys_0.d_irq kbfifo.out_irq interrupt
set_connection_parameter_value nios2_qsys_0.d_irq/kbfifo.out_irq irqNumber 10
add_connection nios2_qsys_0.d_irq pio_FDEJECT.irq interrupt
set_connection_parameter_value nios2_qsys_0.d_irq/pio_FDEJECT.irq irqNumber 6
add_connection nios2_qsys_0.d_irq pio_FDMOTOR.irq interrupt
set_connection_parameter_value nios2_qsys_0.d_irq/pio_FDMOTOR.irq irqNumber 4
add_connection nios2_qsys_0.d_irq pio_NVSAVE.irq interrupt
set_connection_parameter_value nios2_qsys_0.d_irq/pio_NVSAVE.irq irqNumber 5
add_connection nios2_qsys_0.d_irq pio_SASISEL.irq interrupt
set_connection_parameter_value nios2_qsys_0.d_irq/pio_SASISEL.irq irqNumber 3
add_connection nios2_qsys_0.d_irq spi_fast.irq interrupt
set_connection_parameter_value nios2_qsys_0.d_irq/spi_fast.irq irqNumber 2
add_connection nios2_qsys_0.d_irq spi_slow.irq interrupt
set_connection_parameter_value nios2_qsys_0.d_irq/spi_slow.irq irqNumber 1

# exported interfaces
add_interface clk clock sink
set_interface_property clk EXPORT_OF clk_0.clk_in
add_interface spi_sdcard_slow conduit end
set_interface_property spi_sdcard_slow EXPORT_OF spi_slow.external
add_interface reset reset sink
set_interface_property reset EXPORT_OF clk_0.clk_in_reset
add_interface spi_sdcard_fast conduit end
set_interface_property spi_sdcard_fast EXPORT_OF spi_fast.external
add_interface sasidin conduit end
set_interface_property sasidin EXPORT_OF pio_SASIIN.external_connection
add_interface sasidout conduit end
set_interface_property sasidout EXPORT_OF pio_SASIOUT.external_connection
add_interface sasisel conduit end
set_interface_property sasisel EXPORT_OF pio_SASISEL.external_connection
add_interface sasibsy conduit end
set_interface_property sasibsy EXPORT_OF pio_SASIBSY.external_connection
add_interface sasireq conduit end
set_interface_property sasireq EXPORT_OF pio_SASIREQ.external_connection
add_interface sasiack conduit end
set_interface_property sasiack EXPORT_OF pio_SASIACK.external_connection
add_interface sasiio conduit end
set_interface_property sasiio EXPORT_OF pio_SASIIO.external_connection
add_interface sasicd conduit end
set_interface_property sasicd EXPORT_OF pio_SASICD.external_connection
add_interface sasimsg conduit end
set_interface_property sasimsg EXPORT_OF pio_SASIMSG.external_connection
add_interface sasirst conduit end
set_interface_property sasirst EXPORT_OF pio_SASIRST.external_connection
add_interface spihs conduit end
set_interface_property spihs EXPORT_OF pio_SPIHS.external_connection
add_interface vram avalon slave
set_interface_property vram EXPORT_OF vram.s2
add_interface vclk clock sink
set_interface_property vclk EXPORT_OF vclk.clk_in
add_interface model conduit end
set_interface_property model EXPORT_OF model.external_connection
add_interface sdcs conduit end
set_interface_property sdcs EXPORT_OF pio_SDCS.external_connection
add_interface nvsram avalon slave
set_interface_property nvsram EXPORT_OF nvsram.s2
add_interface sysclk clock sink
set_interface_property sysclk EXPORT_OF sysclk.clk_in
add_interface nvsave conduit end
set_interface_property nvsave EXPORT_OF pio_NVSAVE.external_connection
add_interface fdclk clock sink
set_interface_property fdclk EXPORT_OF fdclk.clk_in
add_interface initdone conduit end
set_interface_property initdone EXPORT_OF pio_INITDONE.external_connection
add_interface fdramaddr conduit end
set_interface_property fdramaddr EXPORT_OF pio_FDRAMADDR.external_connection
add_interface fdmodein conduit end
set_interface_property fdmodein EXPORT_OF pio_FDMODEIN.external_connection
add_interface fdwrote conduit end
set_interface_property fdwrote EXPORT_OF pio_FDWROTE.external_connection
add_interface fdsel0 conduit end
set_interface_property fdsel0 EXPORT_OF pio_FDSEL0.external_connection
add_interface fdsel1 conduit end
set_interface_property fdsel1 EXPORT_OF pio_FDSEL1.external_connection
add_interface fdeject conduit end
set_interface_property fdeject EXPORT_OF pio_FDEJECT.external_connection
add_interface fdindisk conduit end
set_interface_property fdindisk EXPORT_OF pio_FDINDISK.external_connection
add_interface fdmodeout conduit end
set_interface_property fdmodeout EXPORT_OF pio_FDMODEOUT.external_connection
add_interface fdwprot conduit end
set_interface_property fdwprot EXPORT_OF pio_FDWPROT.external_connection
add_interface curc conduit end
set_interface_property curc EXPORT_OF txt_cursorC.external_connection
add_interface curl conduit end
set_interface_property curl EXPORT_OF txt_cursorL.external_connection
add_interface curen conduit end
set_interface_property curen EXPORT_OF txt_cursoren.external_connection
add_interface fdemuen conduit end
set_interface_property fdemuen EXPORT_OF pio_FDEMUEN.external_connection
add_interface fdramrd conduit end
set_interface_property fdramrd EXPORT_OF pio_FDRAMRD.external_connection
add_interface fdram avalon slave
set_interface_property fdram EXPORT_OF FDRAM.s2
add_interface kbfifoin avalon slave
set_interface_property kbfifoin EXPORT_OF kbfifo.in
add_interface fdramwr conduit end
set_interface_property fdramwr EXPORT_OF pio_FDRAMWR.external_connection
add_interface fdebusy conduit end
set_interface_property fdebusy EXPORT_OF pio_FDEBUSY.external_connection
add_interface fdrambusy conduit end
set_interface_property fdrambusy EXPORT_OF pio_FDRAMBUSY.external_connection
add_interface ramclk clock sink
set_interface_property ramclk EXPORT_OF ramclk.clk_in
add_interface fdmodeset conduit end
set_interface_property fdmodeset EXPORT_OF pio_FDMODESET.external_connection
add_interface fdmotor conduit end
set_interface_property fdmotor EXPORT_OF pio_FDMOTOR.external_connection
add_interface fdcpy_fdmode conduit end
set_interface_property fdcpy_fdmode EXPORT_OF fdcpy_fdmode.external_connection
add_interface fdcpy_mfm conduit end
set_interface_property fdcpy_mfm EXPORT_OF fdcpy_mfm.external_connection
add_interface fdcpy_unit conduit end
set_interface_property fdcpy_unit EXPORT_OF fdcpy_unit.external_connection
add_interface fdcpy_emunit conduit end
set_interface_property fdcpy_emunit EXPORT_OF fdcpy_emunit.external_connection
add_interface fdcpy_track conduit end
set_interface_property fdcpy_track EXPORT_OF fdcpy_track.external_connection
add_interface fdcpy_head conduit end
set_interface_property fdcpy_head EXPORT_OF fdcpy_head.external_connection
add_interface fdcpy_recarib conduit end
set_interface_property fdcpy_recarib EXPORT_OF fdcpy_recarib.external_connection
add_interface fdcpy_seek conduit end
set_interface_property fdcpy_seek EXPORT_OF fdcpy_seek.external_connection
add_interface fdcpy_wrdisk conduit end
set_interface_property fdcpy_wrdisk EXPORT_OF fdcpy_wrdisk.external_connection
add_interface fdcpy_rddisk conduit end
set_interface_property fdcpy_rddisk EXPORT_OF fdcpy_rddisk.external_connection
add_interface fdcpy_busy conduit end
set_interface_property fdcpy_busy EXPORT_OF fdcpy_busy.external_connection
add_interface fdcpy_error conduit end
set_interface_property fdcpy_error EXPORT_OF fdcpy_error.external_connection
add_interface fddsel conduit end
set_interface_property fddsel EXPORT_OF fddsel.external_connection
add_interface fdwgate conduit end
set_interface_property fdwgate EXPORT_OF fdwgate.external_connection

set_interconnect_requirement {$system} qsys_mm.clockCrossingAdapter HANDSHAKE
set_interconnect_requirement {$system} qsys_mm.maxAdditionalLatency 1
set_interconnect_requirement {$system} qsys_mm.insertDefaultSlave false

save_system diskemu.qsys
